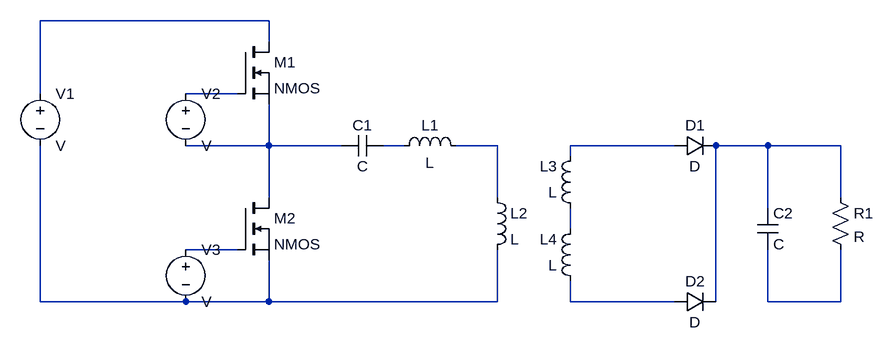
[diagram p0: schematic LLC Draft.asc]
LLC Draft.asc, the LTspice schematic file:
Version 4.1
SHEET 1 1192 680
WIRE 256 48 -96 48
WIRE 256 80 256 48
WIRE -96 160 -96 48
WIRE 208 160 128 160
WIRE 256 240 256 176
WIRE 256 240 128 240
WIRE 368 240 256 240
WIRE 464 240 432 240
WIRE 608 240 544 240
WIRE 880 240 720 240
WIRE 1024 240 944 240
WIRE 1136 240 1024 240
WIRE 720 256 720 240
WIRE 256 320 256 240
WIRE 608 320 608 240
WIRE 1136 320 1136 240
WIRE 1024 336 1024 240
WIRE 720 368 720 336
WIRE 208 400 128 400
WIRE -96 480 -96 240
WIRE 128 480 -96 480
WIRE 256 480 256 416
WIRE 256 480 128 480
WIRE 608 480 608 400
WIRE 608 480 256 480
WIRE 720 480 720 448
WIRE 880 480 720 480
WIRE 944 480 944 240
WIRE 1024 480 1024 400
WIRE 1136 480 1136 400
WIRE 1136 480 1024 480
SYMBOL voltage -96 144 R0
SYMATTR InstName V1
SYMBOL nmos 208 80 R0
SYMATTR InstName M1
SYMBOL nmos 208 320 R0
SYMATTR InstName M2
SYMBOL voltage 128 144 R0
SYMATTR InstName V2
SYMBOL voltage 128 384 R0
SYMATTR InstName V3
SYMBOL cap 368 224 M90
WINDOW 0 0 32 VBottom 2
WINDOW 3 32 32 VTop 2
SYMATTR InstName C1
SYMBOL ind 448 256 R270
WINDOW 0 32 56 VTop 2
WINDOW 3 5 56 VBottom 2
SYMATTR InstName L1
SYMBOL ind 592 304 R0
SYMATTR InstName L2
SYMBOL ind 736 352 R180
WINDOW 0 36 80 Left 2
WINDOW 3 36 40 Left 2
SYMATTR InstName L3
SYMBOL ind 736 464 R180
WINDOW 0 36 80 Left 2
WINDOW 3 36 40 Left 2
SYMATTR InstName L4
SYMBOL diode 880 256 R270
WINDOW 0 32 32 VTop 2
WINDOW 3 0 32 VBottom 2
SYMATTR InstName D1
SYMBOL diode 880 496 R270
WINDOW 0 32 32 VTop 2
WINDOW 3 0 32 VBottom 2
SYMATTR InstName D2
SYMBOL cap 1008 336 R0
SYMATTR InstName C2
SYMBOL res 1120 304 R0
SYMATTR InstName R1

The netlist it stands for:
* LLC Draft.asc
V1 N001 N010 V
M1 N001 N002 N003 N003 NMOS
M2 N003 N009 N010 N010 NMOS
V2 N002 N003 V
V3 N009 N010 V
C1 N003 N004 C
L1 N004 N005 L
L2 N005 N010 L
L3 N008 N006 L
L4 N011 N008 L
D1 N006 N007 D
D2 N011 N007 D
C2 N007 N012 C
R1 N007 N012 R
.model D D
.lib standard.dio
.model NMOS NMOS
.model PMOS PMOS
.lib standard.mos
.backanno
.end